# Altium schematic sheet mach_xa_pin_schematic.SchDoc
size A3
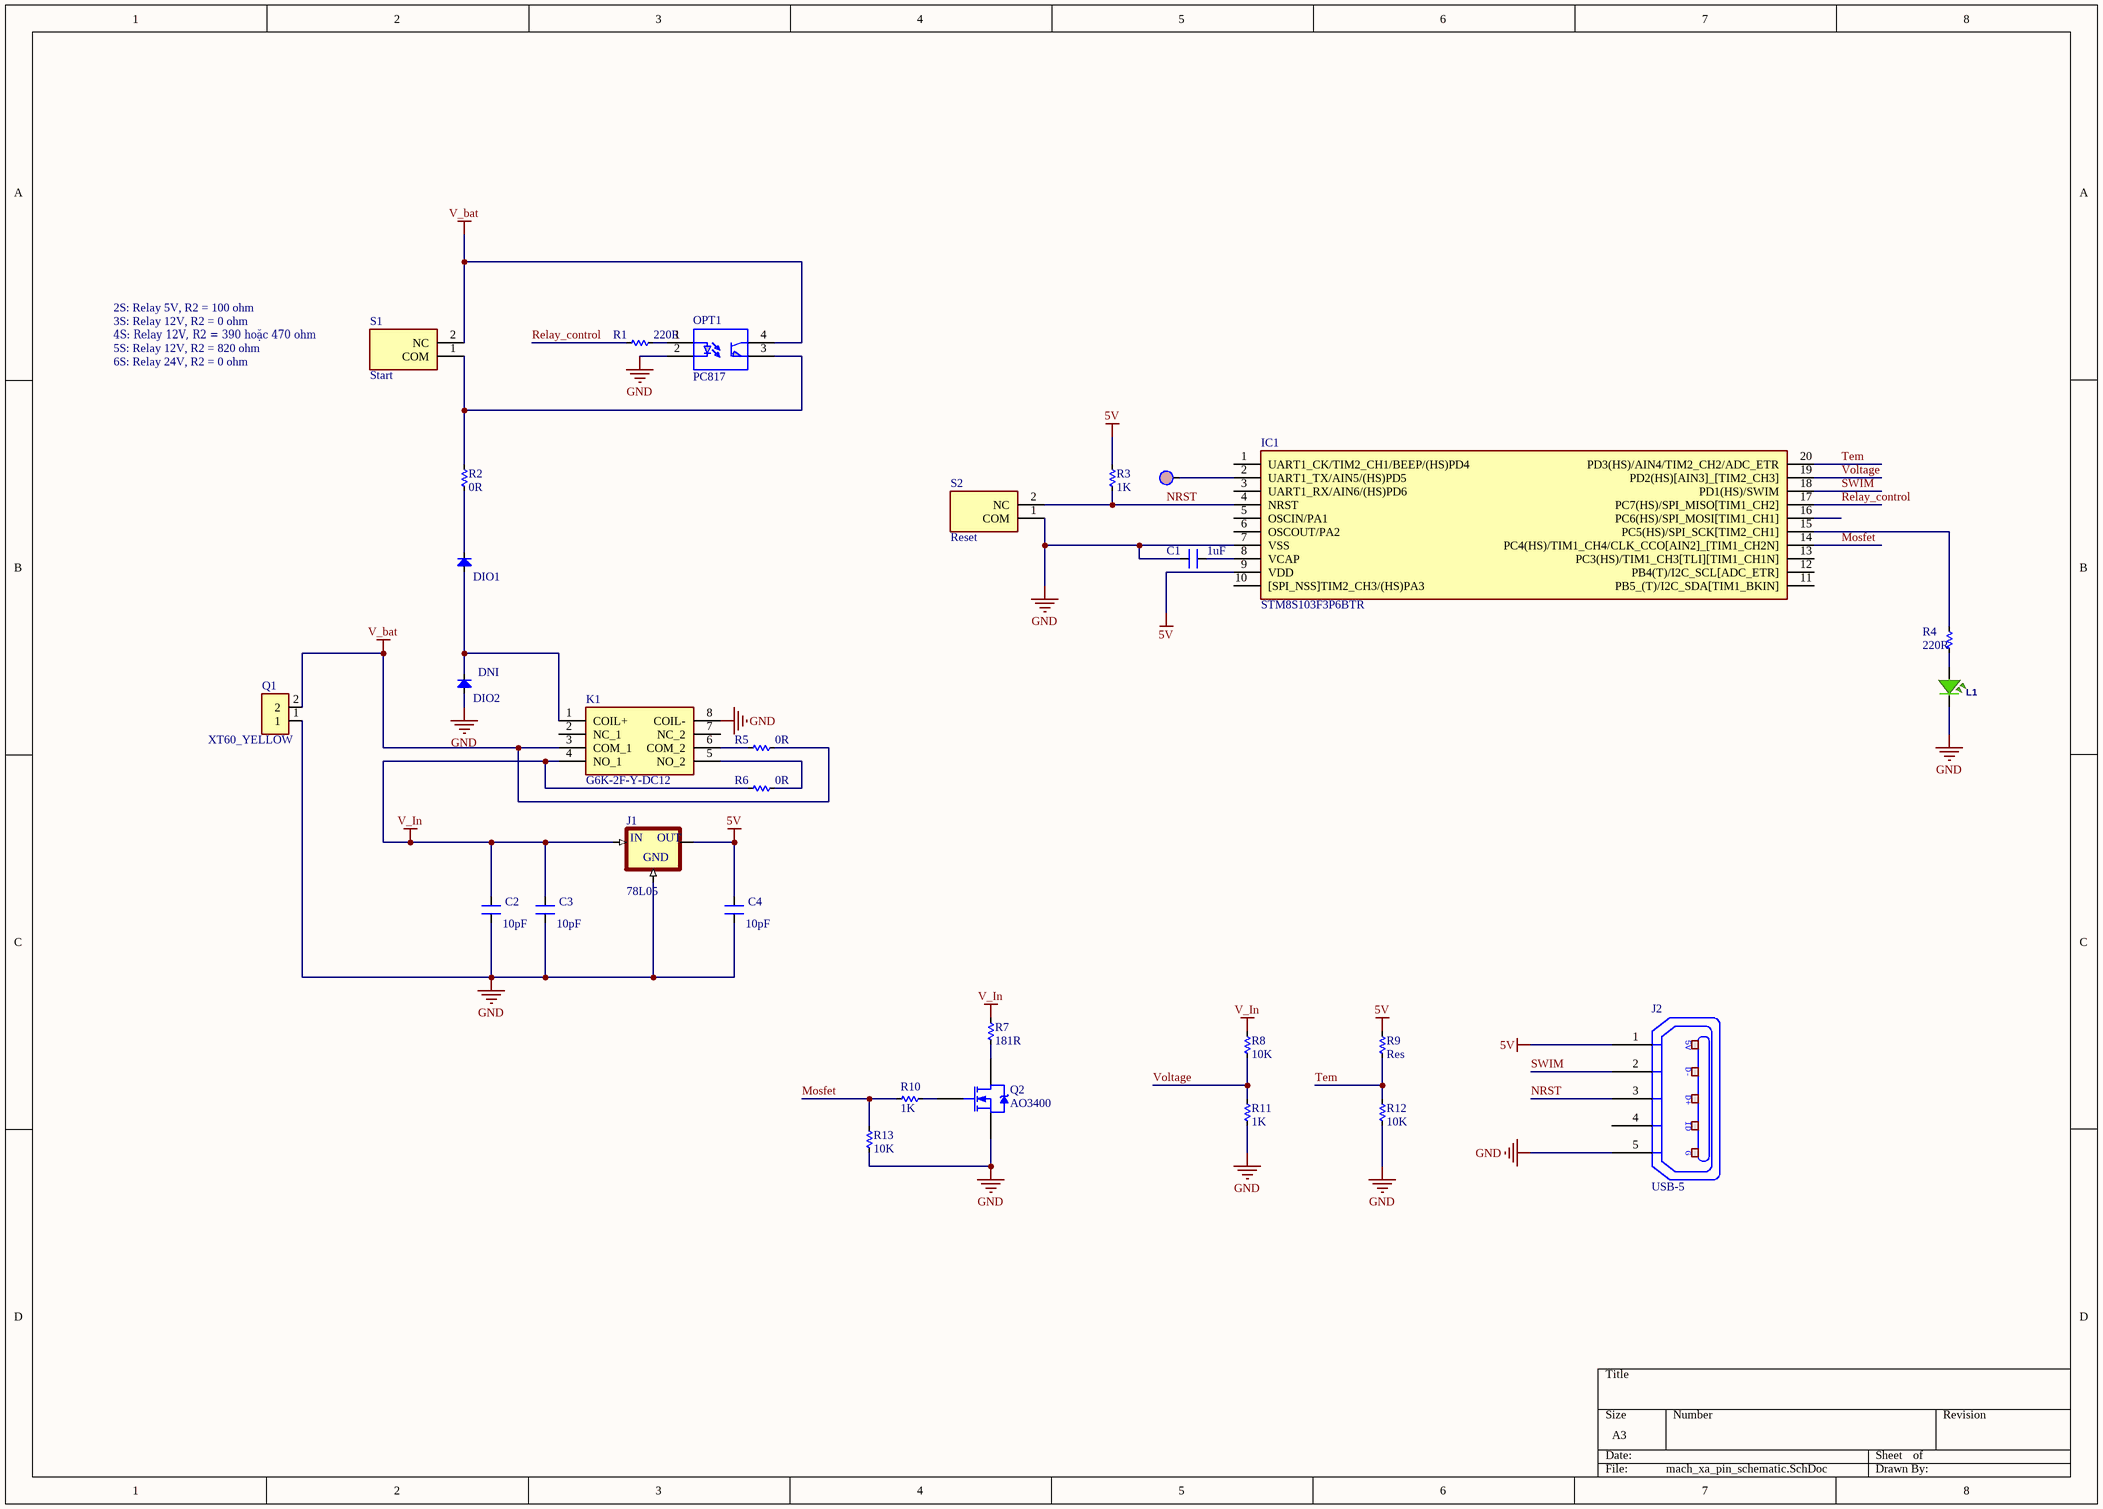
[diagram p0: mach_xa_pin_schematic.SchDoc]

## Parts
C1  1uF  [CN-SMD-0603]
C2  10pF  [CN-SMD-0603]
C3  10pF  [CN-SMD-0603]
C4  10pF  [CN-SMD-0603]
DIO1  Diode SMD  [DIO-SMD-123]  (value not drawn)
DIO2  DNI  [DIO-SMD-123]
IC1  STM8S103F3P6BTR  [SOP65P640X120-20N]
J1  78L05  [SOT89R]
J2  USB-5  [USB-M1]
K1  G6K-2F-Y-DC12  [G6K2FYDC12]
L1  Led 0603 Green  [LED 0603 GREEN]  (value not drawn)
OPT1  PC817  [DIP-4 SMD]
Q1  XT60_YELLOW  [AMASS_XT60PB-M]
Q2  AO3400  [SOT-23_N]
R1  220R  [RES-SMD-0603]
R2  0R  [RES-SMD-0805]
R3  1K  [RES-SMD-0603]
R4  220R  [RES-SMD-0603]
R5  0R  [RES-SMD-0201]
R6  0R  [RES-SMD-0201]
R7  181R  [RES-SMD-2512]
R8  10K  [RES-SMD-0603]
R9  Res  [RES-1/8W-SMALL-2]
R10  1K  [RES-SMD-0603]
R11  1K  [RES-SMD-0603]
R12  10K  [RES-SMD-0603]
R13  10K  [RES-SMD-0603]
S1  Start  [TS1088R02026]
S2  Reset  [TS1088R02026]
TP1  TP  [P-TP 1MM]  (value not drawn)  (no BOM)

## Nets
5V: C4.2 IC1.9(VDD) J1.P$3(OUT) J2.1(P1) R3.1 R9.1
GND: C1.2 C2.1 C3.1 C4.1 DIO2.1(A) IC1.7(VSS) J1.P$2(GND) J2.5(P5) K1.8(COIL-) L1.2 OPT1.2(K) Q1.1 Q2.2(S) R11.2 R12.2 R13.1 S2.1(COM)
V_bat: K1.3(COM_1) OPT1.4(COLETOR) Q1.2 R5.1 S1.2(NC)
V_In: C2.2 C3.2 J1.P$1(IN) K1.4(NO_1) R6.2 R7.1 R8.1
Mosfet: IC1.14(PC4(HS)/TIM1_CH4/CLK_CCO[AIN2]_[TIM1_CH2N]) R10.1 R13.2
NRST: IC1.4(NRST) J2.3(P3) R3.2 S2.2(NC)
Relay_control: IC1.17(PC7(HS)/SPI_MISO[TIM1_CH2]) R1.1
SWIM: IC1.18(PD1(HS)/SWIM) J2.2(P2)
Tem: IC1.20(PD3(HS)/AIN4/TIM2_CH2/ADC_ETR) R9.2 R12.1
Voltage: IC1.19(PD2(HS)[AIN3]_[TIM2_CH3]) R8.2 R11.1
NetC1_1: C1.1 IC1.8(VCAP)
NetDIO1_1: DIO1.1(A) DIO2.2(K) K1.1(COIL+)
NetDIO1_2: DIO1.2(K) R2.2
NetIC1_2: IC1.2(UART1_TX/AIN5/(HS)PD5) TP1.1
NetIC1_15: IC1.15(PC5(HS)/SPI_SCK[TIM2_CH1]) R4.1
NetK1_5: K1.5(NO_2) R6.1
NetK1_6: K1.6(COM_2) R5.2
NetL1_1: L1.1 R4.2
NetOPT1_1: OPT1.1(A) R1.2
NetOPT1_3: OPT1.3(EMISSOR) R2.1 S1.1(COM)
NetQ2_1: Q2.1(G) R10.2
NetQ2_3: Q2.3(D) R7.2

Not connected (* = marked no-connect by the designer): IC1 1(UART1_CK/TIM2_CH1/BEEP/(HS)PD4) 3(UART1_RX/AIN6/(HS)PD6) 5(OSCIN/PA1) 6(OSCOUT/PA2) 10([SPI_NSS]TIM2_CH3/(HS)PA3) 11(PB5_(T)/I2C_SDA[TIM1_BKIN]) 12(PB4(T)/I2C_SCL[ADC_ETR]) 13(PC3(HS)/TIM1_CH3[TLI][TIM1_CH1N]) 16(PC6(HS)/SPI_MOSI[TIM1_CH1]); J2 4(P4); K1 2(NC_1) 7(NC_2)

## Notes on the sheet
- 2S: Relay 5V, R2 = 100 ohm
- 3S: Relay 12V, R2 = 0 ohm
- 4S: Relay 12V, R2 = 390 hoặc 470 ohm
- 5S: Relay 12V, R2 = 820 ohm
- 6S: Relay 24V, R2 = 0 ohm
- (in symbol USB-5) 5V; D-; D+; ID; G

## Library data of the parts
C1-C4 = CN: Value: 33pF
DIO1 DIO2 = Diode SMD: Default Diode; Code - JEDEC: DO-214-AB; Value: 1N5007; Published: 8-Jun-2000; Revision: July-2002: Re-released for DXP Platform.; Publisher: Altium Limited
IC1 = STM8S103F3P6BTR: Integrated Circuit; Manufacturer_Name: STMicroelectronics; Height: 1.2mm; Manufacturer_Part_Number: STM8S103F3P6BTR
J1 = 78L05: IC REG LINEAR 5V 100MA SOT89-3; MF: Hottech Co; Value: *; Availability: In Stock; Price: None; SnapEDA_Link: https://www.snapeda.com/parts/78L05/BitFenix+Co.+Ltd./view-part/?ref=snap; Check_prices: https://www.snapeda.com/parts/78L05/BitFenix+Co.+Ltd./view-part/?ref=eda; Purchase-URL: https://pricing.snapeda.com/search/part/78L05/?ref=eda; Package: None; MP: 78L05
J2 = USB-5: Manufacturer: FCI; Manufacturer Part Number: 10118193-0001LF; Connector Type: USB - micro B; Number of Contacts: 5; Gender: Receptacle; Specifications: USB 2.0; .Creator: MM; .Checked PCB: RF; Supplier 1: Digi-Key; RoHS: RoHS Compliant; Category: Connectors, Interconnects; Stock 1: 28642; Pricing 1: 1=0.46, 10=0.433, 25=0.3712, 50=0.3156, 100=0.3032, 250=0.27224, 500=0.25988 (USD); Packaging: Cut Tape (CT); Mounting Type: Surface Mount, Right Angle, Horizontal; Features: Shielded, Solder Retention; Ingress Protection: -; ComponentLink1URL: http://portal.fciconnect.com/Comergent//fci/drawing/10118193.pdf; ComponentLink1Description: http://portal.fciconnect.com/Comergent//fci/drawing/10118193.pdf; Supplier Part Number 1: 609-4616-1-ND; .Checked SCH: MM
K1 = G6K-2F-Y-DC12: Relay or Contactor; Manufacturer_Name: Omron Electronics; Datasheet Link: https://datasheet.lcsc.com/szlcsc/1906271837_Omron-Electronics-G6K-2F-Y-DC12_C397194.pdf; Height: 5.4mm; Manufacturer_Part_Number: G6K-2F-Y-DC12; Mouser Part Number: 653-G6K-2F-Y-DC12; Mouser Price/Stock: https://www.mouser.co.uk/ProductDetail/Omron-Electronics/G6K-2F-Y-DC12?qs=lK7M36XCk6Jyttpb23V04g%3D%3D
OPT1 = PC817: OptoAcoplador 4 terminais; Encapsulamento: SMD; Descrição: OptoAcoplador 4 Terminais; Valor: *; Marca: *; Observação: *; Modelo: PC817
Q1 = XT60_YELLOW: Power connector; 65A; PIN: 2; Colour: yellow; MP: XT60 YELLOW; MF: Pololu; Package: None; SnapEDA_Link: https://www.snapeda.com/parts/XT60%20YELLOW/Pololu/view-part/423230/?ref=snap; Availability: Unavailable; Price: None; Value: *
Q2 = IRLML2402: HEXFET Power MOSFET; Published: 8-Jun-2000; LatestRevisionDate: 20-Nov-2009; LatestRevisionNote: IPC-7351 Footprint Added.; DatasheetVersion: Aug-1997; PackageReference: SOT-23; Publisher: Altium Limited; PackageDescription: 3-Pin SOT-23 Package 0.95 mm Pitch, 2.3 mm Lead Span; ComponentLink1Description: Manufacturer Link; ComponentLink1URL: http://www.irf.com/; ComponentLink2Description: Datasheet; ComponentLink2URL: http://www.irf.com/product-info/datasheets/data/irlml2402.pdf
R1-R8 R10-R13 = Res-SMD: Resistor; Manufacturer: Generic Components; Class: Passive; Published: 08/06/2000; Publisher: Altium Hobart Technology Centre
R9 = Res: Manufacturer: Generic Components; Class: Passive; SubClass: R; Published: 08/06/2000; Publisher: Altium Hobart Technology Centre
S1 S2 = TS-1088R-02026: Switch; Manufacturer_Name: XUNPU; Datasheet Link: https://datasheet.lcsc.com/szlcsc/1912111437_XUNPU-TS-1088R-02026_C455280.pdf; Height: 2.2mm; Manufacturer_Part_Number: TS-1088R-02026
TP1 = P-TESTPOINT